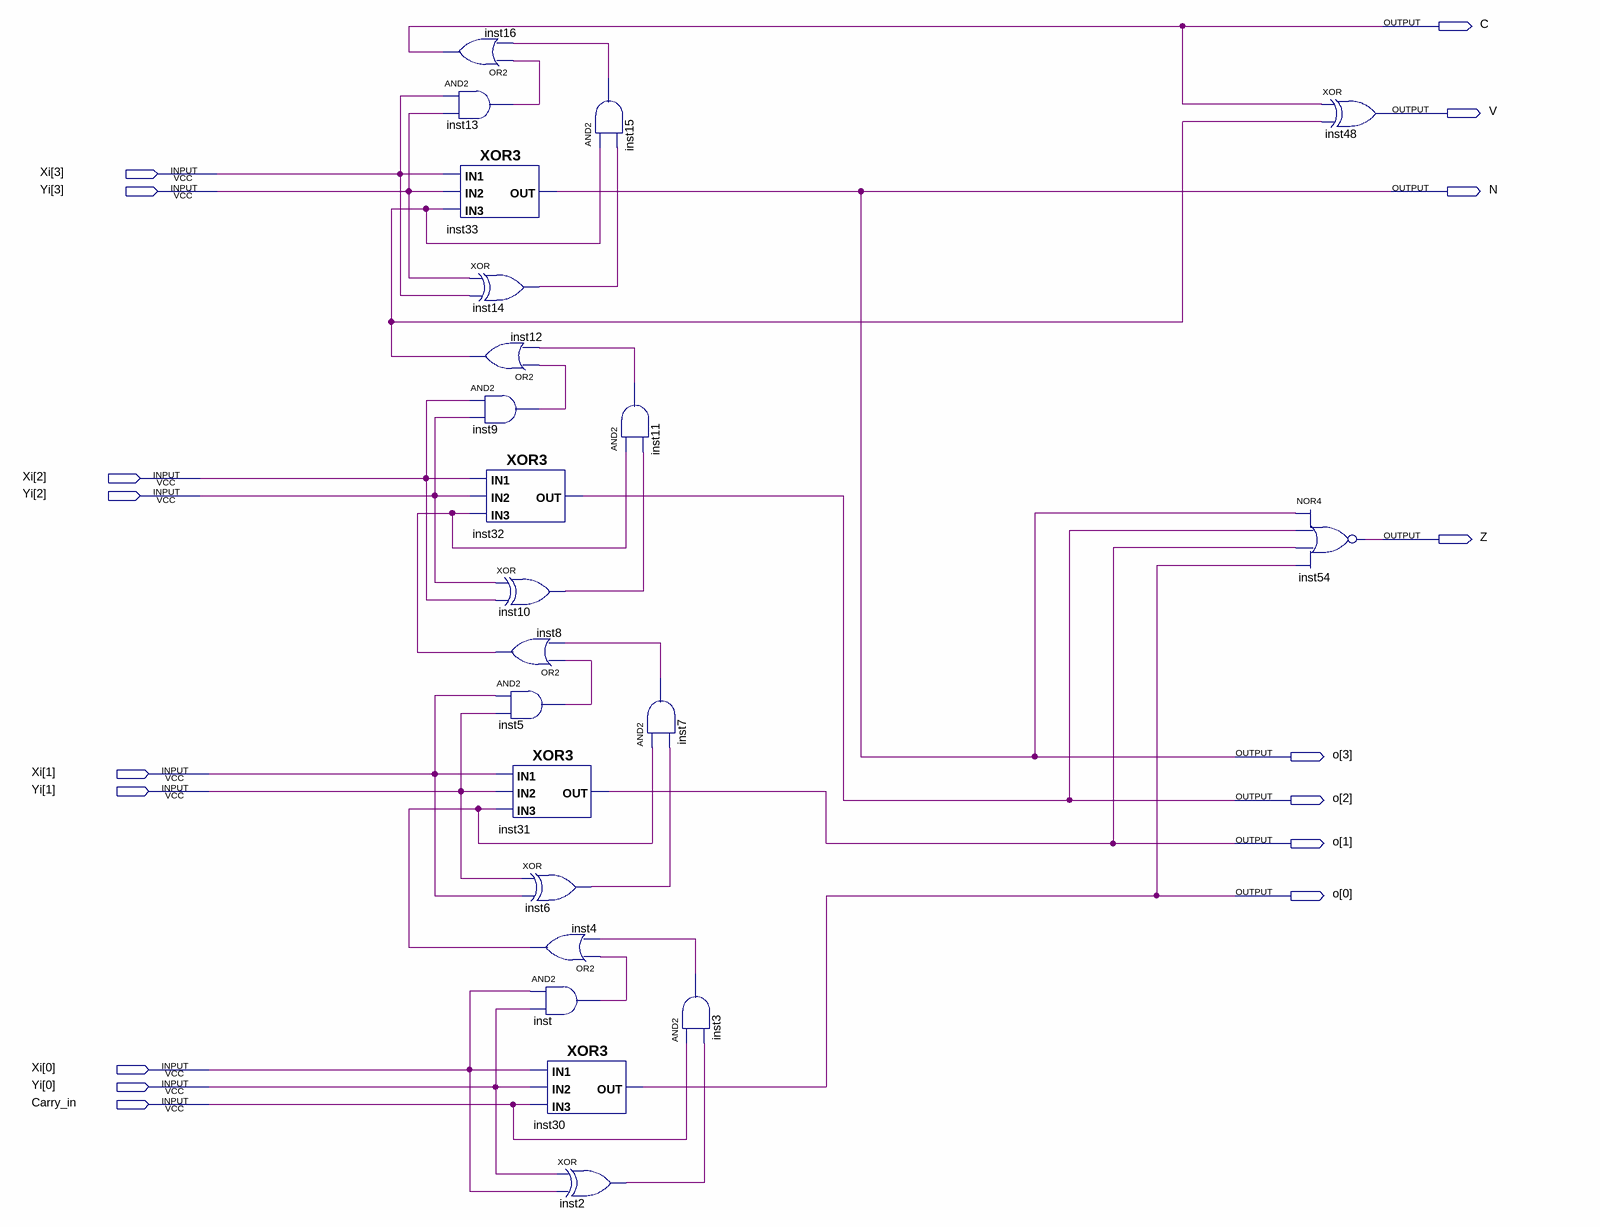
[diagram p0: schematic sheet]
// Quartus schematic Somador.bdf as structural Verilog: 22 symbols, 17 pins
module Somador (
  input  [3:0] Xi,
  input  [3:0] Yi,
  input  Carry_in,
  output C,
  output V,
  output N,
  output Z,
  output [3:0] o
);

  wire inst2_out, inst3_out, inst4_out, inst5_out, inst6_out, inst7_out, inst8_out, inst9_out, inst10_out,
       inst11_out, inst12_out, inst13_out, inst14_out, inst15_out, inst_out;

  or inst16 (C, inst13_out, inst15_out);
  and inst13 (inst13_out, Xi[3], Yi[3]);
  XOR3 inst33 (.IN3(inst12_out), .IN1(Xi[3]), .IN2(Yi[3]), .OUT(N));
  xor inst14 (inst14_out, Yi[3], Xi[3]);
  or inst12 (inst12_out, inst9_out, inst11_out);
  and inst9 (inst9_out, Xi[2], Yi[2]);
  XOR3 inst32 (.IN3(inst8_out), .IN1(Xi[2]), .IN2(Yi[2]), .OUT(o[2]));
  xor inst10 (inst10_out, Yi[2], Xi[2]);
  or inst8 (inst8_out, inst5_out, inst7_out);
  and inst5 (inst5_out, Xi[1], Yi[1]);
  XOR3 inst31 (.IN3(inst4_out), .IN1(Xi[1]), .IN2(Yi[1]), .OUT(o[1]));
  and inst15 (inst15_out, inst12_out, inst14_out);
  xor inst6 (inst6_out, Yi[1], Xi[1]);
  or inst4 (inst4_out, inst_out, inst3_out);
  and inst (inst_out, Xi[0], Yi[0]);
  XOR3 inst30 (.IN3(Carry_in), .IN1(Xi[0]), .IN2(Yi[0]), .OUT(o[0]));
  xor inst2 (inst2_out, Yi[0], Xi[0]);
  and inst11 (inst11_out, inst8_out, inst10_out);
  and inst7 (inst7_out, inst4_out, inst6_out);
  and inst3 (inst3_out, Carry_in, inst2_out);
  xor inst48 (V, C, inst12_out);
  nor inst54 (Z, N, o[2], o[1], o[0]);

  assign o[3] = N;
endmodule
